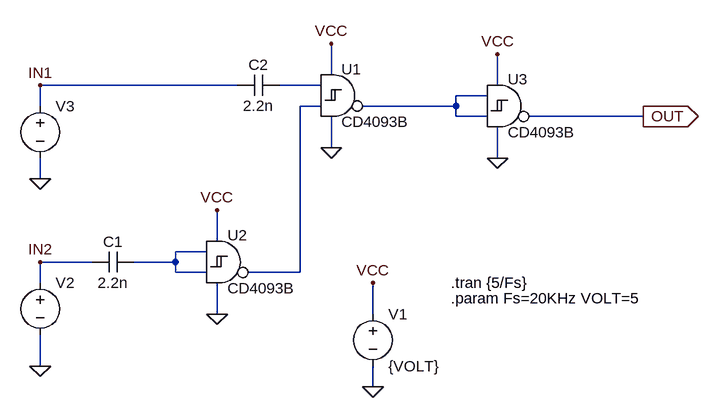
[diagram p0: schematic v1.0.asc]
v1.0.asc, the LTspice schematic file:
Version 4.1
SHEET 1 1776 932
WIRE 720 336 720 288
WIRE 576 352 272 352
WIRE 704 352 640 352
WIRE 976 352 976 304
WIRE 960 368 912 368
WIRE 272 384 272 352
WIRE 704 384 672 384
WIRE 912 384 912 368
WIRE 912 384 768 384
WIRE 912 400 912 384
WIRE 960 400 912 400
WIRE 1200 400 1024 400
WIRE 720 448 720 400
WIRE 976 464 976 416
WIRE 272 496 272 464
WIRE 544 592 544 544
WIRE 528 608 480 608
WIRE 352 624 272 624
WIRE 480 624 480 608
WIRE 480 624 416 624
WIRE 480 640 480 624
WIRE 528 640 480 640
WIRE 672 640 672 384
WIRE 672 640 592 640
WIRE 272 656 272 624
WIRE 544 704 544 656
WIRE 784 704 784 656
WIRE 272 784 272 736
WIRE 784 816 784 784
FLAG 784 816 0
FLAG 784 656 VCC
FLAG 272 496 0
FLAG 272 352 IN1
FLAG 1200 400 OUT
IOPIN 1200 400 Out
FLAG 272 784 0
FLAG 272 624 IN2
FLAG 720 288 VCC
FLAG 720 448 0
FLAG 544 544 VCC
FLAG 544 704 0
FLAG 976 304 VCC
FLAG 976 464 0
SYMBOL voltage 784 688 R0
WINDOW 123 0 0 Left 0
WINDOW 39 0 0 Left 0
SYMATTR InstName V1
SYMATTR Value {VOLT}
SYMBOL voltage 272 368 R0
WINDOW 3 41 64 Invisible 2
WINDOW 123 0 0 Left 0
WINDOW 39 0 0 Left 0
SYMATTR Value PULSE(0 {VOLT} 0 1n 1n {0.5/Fs} {1/Fs})
SYMATTR InstName V3
SYMBOL cap 352 640 R270
WINDOW 0 32 32 VTop 2
WINDOW 3 0 32 VBottom 2
SYMATTR InstName C1
SYMATTR Value 2.2n
SYMBOL voltage 272 640 R0
WINDOW 3 41 64 Invisible 2
WINDOW 123 0 0 Left 0
WINDOW 39 0 0 Left 0
SYMATTR Value PULSE(0 {VOLT} {0.25/Fs} 1n 1n {0.5/Fs} {1/Fs})
SYMATTR InstName V2
SYMBOL MyLib\\Digital\\CD4093B 736 304 R0
SYMATTR InstName U1
SYMBOL MyLib\\Digital\\CD4093B 560 560 R0
SYMATTR InstName U2
SYMBOL MyLib\\Digital\\CD4093B 992 320 R0
SYMATTR InstName U3
SYMBOL cap 576 368 R270
WINDOW 0 32 32 VTop 2
WINDOW 3 0 32 VBottom 2
SYMATTR InstName C2
SYMATTR Value 2.2n
TEXT 904 680 Left 2 !.param Fs=20KHz VOLT=5
TEXT 904 656 Left 2 !.tran {5/Fs}

The netlist it stands for:
* v1.0.asc
V1 VCC 0 {VOLT}
V3 IN1 0 PULSE(0 {VOLT} 0 1n 1n {0.5/Fs} {1/Fs})
C1 IN2 N004 2.2n
V2 IN2 0 PULSE(0 {VOLT} {0.25/Fs} 1n 1n {0.5/Fs} {1/Fs})
X§U1 N001 N003 N002 VCC 0 CD4093B vdd=5 speed=3 tripdt=40n  ; pins A B Y VDD GND
X§U2 N004 N004 N003 VCC 0 CD4093B vdd=5 speed=3 tripdt=40n  ; pins A B Y VDD GND
X§U3 N002 N002 OUT VCC 0 CD4093B vdd=5 speed=3 tripdt=40n  ; pins A B Y VDD GND
C2 IN1 N001 2.2n
.param Fs=20KHz VOLT=5
.tran {5/Fs}
.lib MyLib/Digital/_CD4xxx.lib
.backanno
.end